# Altium schematic sheet CARMA-PAM.SchDoc
size OrCAD B; SheetNumber: 0; SheetTotal: 0; PageSetup: Record=PageOptions|CenterHorizontal=True|CenterVertical=True|PrintScale=0.68|XCorrection=1.00|YCorrection=1.00|PrintKind=1|BorderSize=5000000|LeftOffset=0|BottomOffset=0|Orientation=2|PaperLength=1000|PaperWidth=1000|Scale=100|PaperSource=15|PrintQuality=600|MediaType=1|DitherType=10|PaperKind=Letter|PrintScaleMode=1
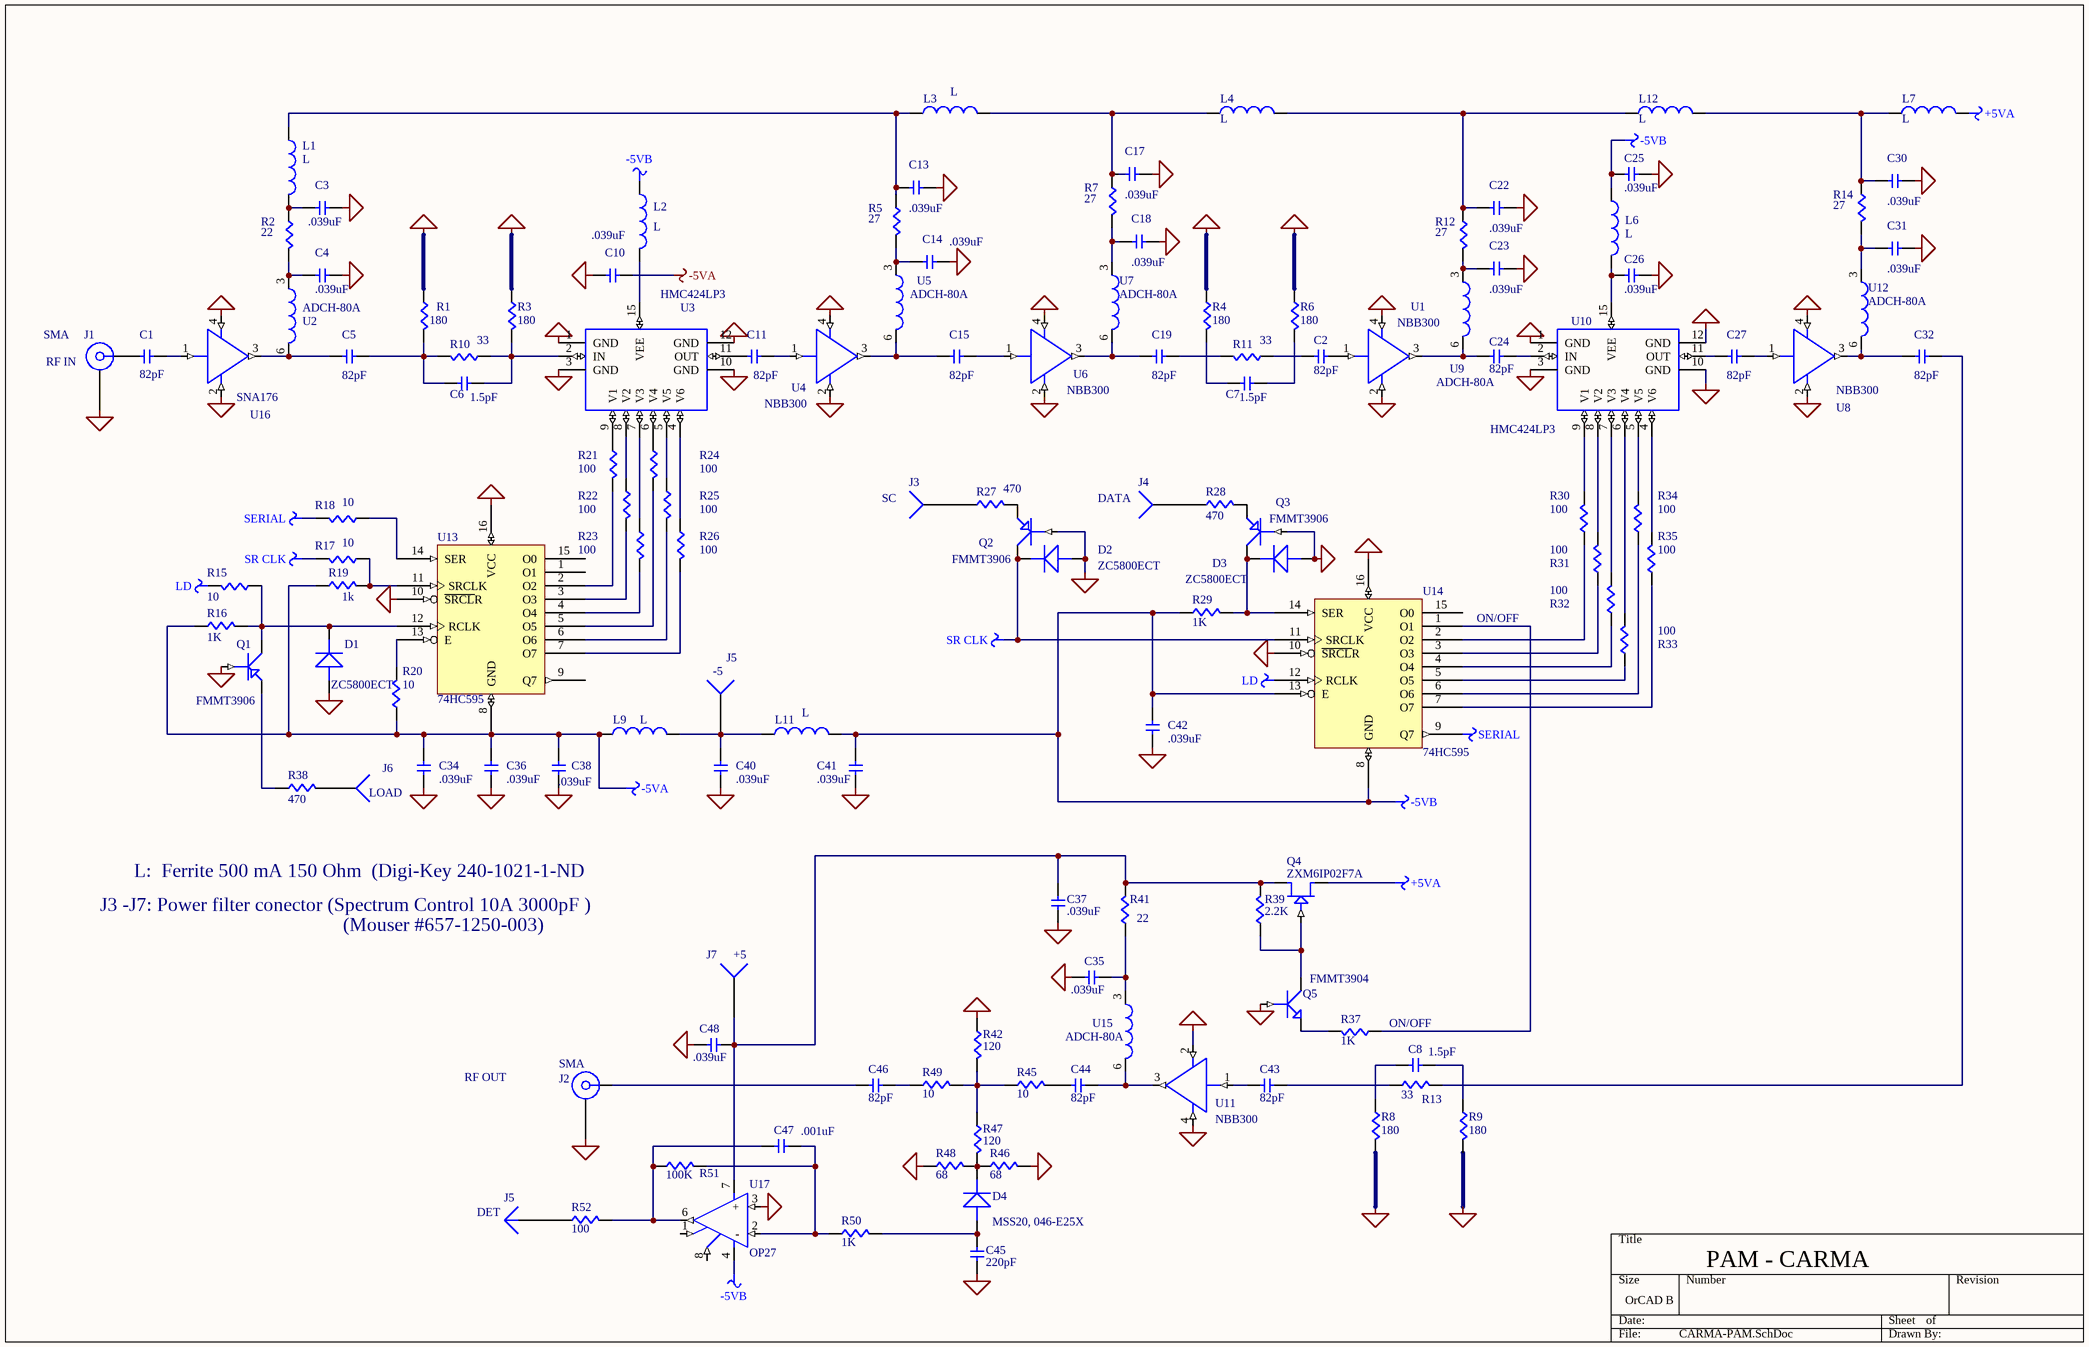
[diagram p0: CARMA-PAM.SchDoc]

## Parts
(Parts that share a designator on the sheet are numbered #1, #2 ... from top to bottom, then left to right.)
C1  82pF
C2  82pF
C3  .039uF
C4  .039uF
C5  82pF
C6  1.5pF
C7  1.5pF
C8  1.5pF
C10  .039uF
C11  82pF
C13  .039uF
C14  .039uF
C15  82pF
C17  .039uF
C18  .039uF
C19  82pF
C22  .039uF
C23  .039uF
C24  82pF
C25  .039uF
C26  .039uF
C27  82pF
C30  .039uF
C31  .039uF
C32  82pF
C34  .039uF
C35  .039uF
C36  .039uF
C37  .039uF
C38  .039uF
C40  .039uF
C41  .039uF
C42  .039uF
C43  82pF
C44  82pF
C45  220pF
C46  82pF
C47  .001uF
C48  .039uF
D1  ZC5800ECT
D2  ZC5800ECT
D3  ZC5800ECT
D4  MSS20, 046-E25X
J1  SMA
J2  SMA
J3  SC
J4  DATA
J5#1  -5
J5#2  DET
J7  +5
L1  L
L2  L
L3  L
L4  L
L6  L
L7  L
L9  L
L11  L
L12  L
LOAD  J6
Q1  FMMT3906
Q2  FMMT3906
Q3  FMMT3906
Q4  ZXM6IP02F7A
Q5  FMMT3904
R1  180
R2  22  [1206]
R3  180
R4  180
R5  27
R6  180
R7  27
R8  180
R9  180
R10  33
R11  33
R12  27
R13  33
R14  27
R15  10
R16  1K
R17  10
R18  10
R19  1k
R20  10
R21  100
R22  100
R23  100
R24  100
R25  100
R26  100
R27  470
R28  470
R29  1K
R30  100
R31  100
R32  100
R33  100
R34  100
R35  100
R37  1K
R38  470
R39  2.2K
R41  22
R42  120
R45  10
R46  68
R47  120
R48  68
R49  10
R50  1K
R51  100K
R52  100
U1  NBB300
U2  ADCH-80A
U3  HMC424LP3
U4  NBB300
U5  ADCH-80A
U6  NBB300
U7  ADCH-80A
U8  NBB300
U9  ADCH-80A
U10  HMC424LP3
U11  NBB300
U12  ADCH-80A
U13  74HC595  [DIP16]
U14  74HC595  [DIP16]
U15  ADCH-80A
U16  SNA176
U17  OP27  [DIP8]

## Nets
+5VA: L7.2 Q4.D
-5VA: C10.1 C34.1 C36.1 C38.1 L9.1 R16.1 R19.1 R20.1 U13.8(GND)
-5VB: C25.1 C41.1 C42.1 L2.1 L6.1 L11.2 R29.1 U14.8(GND) U14.13(E) U17.4(MINUS_V)
GND: C3.2 C4.2 C10.2 C13.2 C14.2 C17.2 C18.2 C22.2 C23.2 C25.2 C26.2 C30.2 C31.2 C34.2 C35.2 C36.2 C37.2 C38.2 C40.2 C41.2 C42.2 C45.2 C48.2 D1.1 D2.1 D3.1 J1.2 J2.2 Q1.2 Q2.2 Q3.2 Q5.2 R1.2 R3.2 R4.2 R6.2 R8.2 R9.2 R42.2 R46.1 R48.2 U1.2 U1.4 U3.1(GND) U3.3(GND) U3.10(GND) U3.12(GND) U4.2 U4.4 U6.2 U6.4 U8.2 U8.4 U10.1(GND) U10.3(GND) U10.10(GND) U10.12(GND) U11.2 U11.4 U13.8(GND) U13.10(~{SRCL}R) U13.16(VCC) U14.8(GND) U14.10(~{SRCL}R) U14.16(VCC) U16.2 U16.4 U17.3(+)
LD: R15.2 U14.12(RCLK)
SERIAL: R18.2 U14.9(Q7)
SR CLK: D2.2 Q2.3 R17.2 U14.11(SRCLK)
VCC: U13.16(VCC) U14.16(VCC)
NetC1_1: C1.1 J1.1
NetC1_2: C1.2 U16.1(IN)
NetC2_1: C2.1 R11.2
NetC2_2: C2.2 U1.1(IN)
NetC3_1: C3.1 L1.2 R2.1
NetC4_1: C4.1 R2.2 U2.3
NetC5_1: C5.1 U2.6 U16.3(OUT])
NetC5_2: C5.2 C6.1 R1.1 R10.1
NetC6_2: C6.2 R3.1 R10.2 U3.2(IN)
NetC7_1: C7.1 R4.1
NetC7_2: C7.2 R6.1
NetC8_1: C8.1 R8.1
NetC8_2: C8.2 R9.1
NetC11_1: C11.1 U3.11(OUT)
NetC11_2: C11.2 U4.1(IN)
NetC13_1: C13.1 L1.1 L3.1 R5.1
NetC14_1: C14.1 R5.2 U5.3
NetC15_1: C15.1 U4.3(OUT]) U5.6
NetC15_2: C15.2 U6.1(IN)
NetC17_1: C17.1 L3.2 L4.1 R7.1
NetC18_1: C18.1 R7.2 U7.3
NetC19_1: C19.1 U6.3(OUT]) U7.6
NetC19_2: C19.2 R11.1
NetC22_1: C22.1 L4.2 L12.1 R12.1
NetC23_1: C23.1 R12.2 U9.3
NetC24_1: C24.1 U1.3(OUT]) U9.6
NetC24_2: C24.2 U10.2(IN)
NetC26_1: C26.1 L6.2 U10.15(VEE)
NetC27_1: C27.1 U10.11(OUT)
NetC27_2: C27.2 U8.1(IN)
NetC30_1: C30.1 L7.1 L12.2 R14.1
NetC31_1: C31.1 R14.2 U12.3
NetC32_1: C32.1 U8.3(OUT]) U12.6
NetC32_2: C32.2 R13.2
NetC35_1: C35.1 R41.2 U15.3
NetC37_1: C37.1 C48.1 J7.1(A) Q4.S R39.1 R41.1 U17.7(PLUS_V)
NetC40_1: C40.1 J5#1.A L9.2 L11.1
NetC43_1: C43.1 R13.1
NetC43_2: C43.2 U11.1(IN)
NetC44_1: C44.1 U11.3(OUT]) U15.6
NetC44_2: C44.2 R45.1
NetC45_1: C45.1 D4.1 R50.1
NetC46_1: C46.1 R49.2
NetC46_2: C46.2 J2.1
NetC47_1: C47.1 R50.2 R51.1 U17.2(-)
NetC47_2: C47.2 R51.2 R52.1 U17.6(OUTPUT)
NetD1_2: D1.2 Q1.3 R15.1 R16.2 U13.12(RCLK)
NetD3_2: D3.2 Q3.3 R29.2 U14.14(SER)
NetD4_2: D4.2 R46.2 R47.1 R48.1
NetJ3_A: J3.A R27.1
NetJ4_A: J4.A R28.1
NetJ5#2_A: J5#2.A R52.2
NetL2_2: L2.2 U3.15(VEE)
NetQ1_1: Q1.1 R38.1
NetQ2_1: Q2.1 R27.2
NetQ3_1: Q3.1 R28.2
NetQ4_G: Q4.G Q5.3 R39.2
NetQ5_1: Q5.1 R37.1
NetR17_1: R17.1 R19.2 U13.11(SRCLK)
NetR18_1: R18.1 U13.14(SER)
NetR20_2: R20.2 U13.13(E)
NetR21_1: R21.1 U3.9(V1)
NetR21_2: R21.2 U13.2(O2)
NetR22_1: R22.1 U3.8(V2)
NetR22_2: R22.2 U13.3(O3)
NetR23_1: R23.1 U3.7(V3)
NetR23_2: R23.2 U13.4(O4)
NetR24_1: R24.1 U3.6(V4)
NetR24_2: R24.2 U13.5(O5)
NetR25_1: R25.1 U3.5(V5)
NetR25_2: R25.2 U13.6(O6)
NetR26_1: R26.1 U3.4(V6)
NetR26_2: R26.2 U13.7(O7)
NetR30_1: R30.1 U14.2(O2)
NetR30_2: R30.2 U10.9(V1)
NetR31_1: R31.1 U14.3(O3)
NetR31_2: R31.2 U10.8(V2)
NetR32_1: R32.1 U14.4(O4)
NetR32_2: R32.2 U10.7(V3)
NetR33_1: R33.1 U14.5(O5)
NetR33_2: R33.2 U10.6(V4)
NetR34_1: R34.1 U14.6(O6)
NetR34_2: R34.2 U10.5(V5)
NetR35_1: R35.1 U14.7(O7)
NetR35_2: R35.2 U10.4(V6)
NetR37_2: R37.2 U14.1(O1)
NetR42_1: R42.1 R45.2 R47.2 R49.1

Not connected (* = marked no-connect by the designer): LOAD A; R38 2; U13 1(O1) 9(Q7) 15(O0); U14 15(O0); U17 1(COMPENSATION_1) 8(COMPENSATION_2)

## Notes on the sheet
- (near J1) RF IN
- ON/OFF
- L:  Ferrite 500 mA 150 Ohm  (Digi-Key 240-1021-1-ND
- J3 -J7: Power filter conector (Spectrum Control 10A 3000pF )
- (Mouser #657-1250-003)
- RF OUT
- PAM - CARMA

## Library data of the parts
C1-C8 C10 C11 C13-C15 C17-C19 C22-C27 C30-C32 C34-C38 C40-C48 = C
D1-D4 = DIODE
J1 J2 = BNC
J3 J4 J5#1 J7 LOAD = CONNECTOR COAX-F
J5#2 = CONNECTOR COAX-M
L1-L4 L6 L7 L9 L11 L12 U2 U5 U7 U9 U12 U15 = INDUCTOR
Q1-Q3 = PNP
Q4 = JFET N
Q5 = NPN
R1-R35 R37-R39 R41 R42 R45-R52 = R: Resistor; 1%: *
U1 U4 U6 U8 U11 U16 = MAR-4
U13 U14 = 74LS595
U17 = 10104: High Speed, Low Power, Wide Supply Range Amp.; AD817AN: *; AD817AR: *